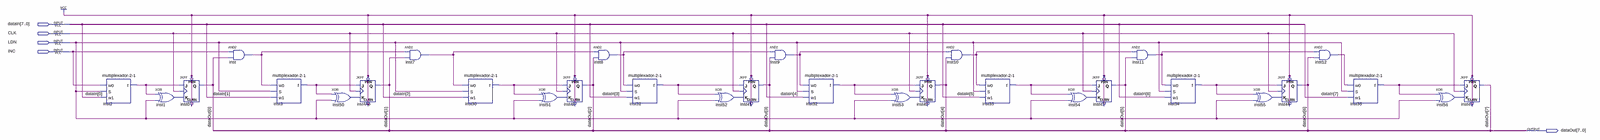
[diagram p0: schematic sheet, whole]
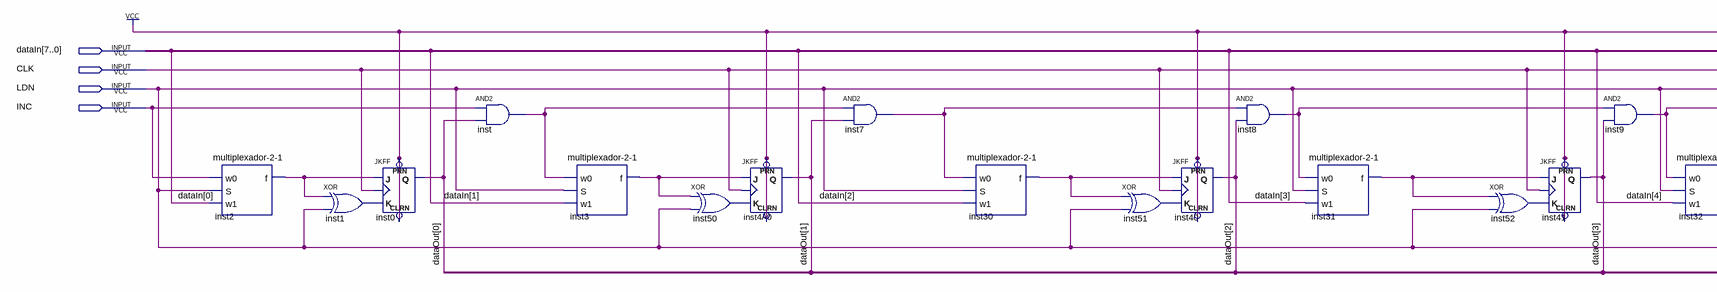
[diagram p1: schematic sheet, left part]
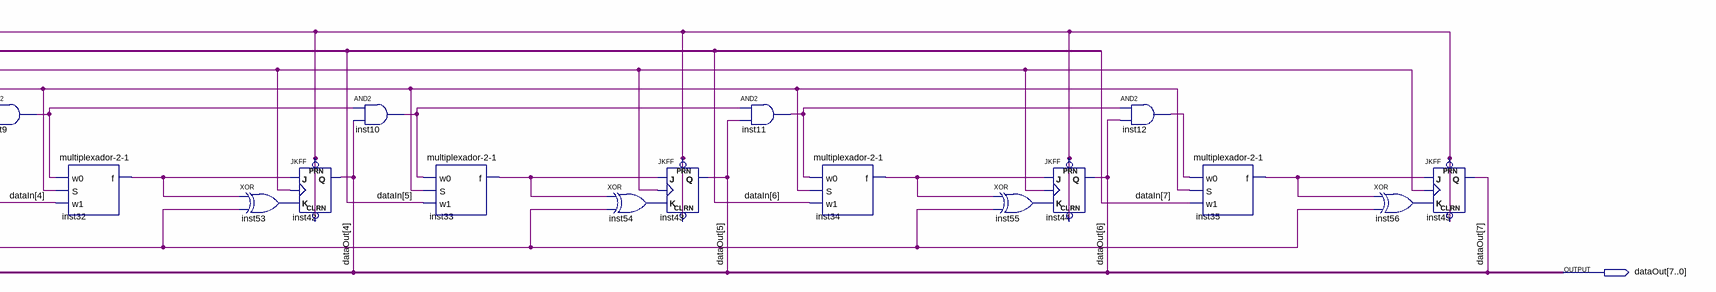
[diagram p2: schematic sheet, right part]
// Quartus schematic registradorPC.bdf as structural Verilog: 31 symbols, 5 pins
module registradorPC (
  input  [7:0] dataIn,
  input  CLK,
  input  LDN,
  input  INC,
  output [7:0] dataOut
);

  wire inst1_out, inst2_f, inst3_f, inst7_out, inst8_out, inst9_out, inst10_out, inst11_out, inst12_out,
       inst30_f, inst31_f, inst32_f, inst33_f, inst34_f, inst35_f, inst50_out, inst51_out, inst52_out,
       inst53_out, inst54_out, inst55_out, inst56_out, inst_out;

  \multiplexador-2-1  inst2 (.w0(INC), .S(LDN), .w1(dataIn[0]), .f(inst2_f));
  xor inst1 (inst1_out, inst2_f, LDN);
  JKFF inst0 (.PRN(1'b1), .CLRN(1'b1), .K(inst1_out), .J(inst2_f), .CLK(CLK), .Q(dataOut[0]));
  and inst (inst_out, INC, dataOut[0]);
  \multiplexador-2-1  inst3 (.w0(inst_out), .S(LDN), .w1(dataIn[1]), .f(inst3_f));
  xor inst50 (inst50_out, inst3_f, LDN);
  JKFF inst4A0 (.PRN(1'b1), .CLRN(1'b1), .K(inst50_out), .J(inst3_f), .CLK(CLK), .Q(dataOut[1]));
  and inst7 (inst7_out, inst_out, dataOut[1]);
  \multiplexador-2-1  inst30 (.w0(inst7_out), .S(LDN), .w1(dataIn[2]), .f(inst30_f));
  xor inst51 (inst51_out, inst30_f, LDN);
  JKFF inst40 (.PRN(1'b1), .CLRN(1'b1), .K(inst51_out), .J(inst30_f), .CLK(CLK), .Q(dataOut[2]));
  and inst8 (inst8_out, inst7_out, dataOut[2]);
  \multiplexador-2-1  inst31 (.w0(inst8_out), .S(LDN), .w1(dataIn[3]), .f(inst31_f));
  xor inst52 (inst52_out, inst31_f, LDN);
  JKFF inst41 (.PRN(1'b1), .CLRN(1'b1), .K(inst52_out), .J(inst31_f), .CLK(CLK), .Q(dataOut[3]));
  and inst9 (inst9_out, inst8_out, dataOut[3]);
  \multiplexador-2-1  inst32 (.w0(inst9_out), .S(LDN), .w1(dataIn[4]), .f(inst32_f));
  xor inst53 (inst53_out, inst32_f, LDN);
  JKFF inst42 (.PRN(1'b1), .CLRN(1'b1), .K(inst53_out), .J(inst32_f), .CLK(CLK), .Q(dataOut[4]));
  and inst10 (inst10_out, inst9_out, dataOut[4]);
  \multiplexador-2-1  inst33 (.w0(inst10_out), .S(LDN), .w1(dataIn[5]), .f(inst33_f));
  xor inst54 (inst54_out, inst33_f, LDN);
  JKFF inst43 (.PRN(1'b1), .CLRN(1'b1), .K(inst54_out), .J(inst33_f), .CLK(CLK), .Q(dataOut[5]));
  and inst11 (inst11_out, inst10_out, dataOut[5]);
  \multiplexador-2-1  inst34 (.w0(inst11_out), .S(LDN), .w1(dataIn[6]), .f(inst34_f));
  xor inst55 (inst55_out, inst34_f, LDN);
  JKFF inst44 (.PRN(1'b1), .CLRN(1'b1), .K(inst55_out), .J(inst34_f), .CLK(CLK), .Q(dataOut[6]));
  and inst12 (inst12_out, inst11_out, dataOut[6]);
  \multiplexador-2-1  inst35 (.w0(inst12_out), .S(LDN), .w1(dataIn[7]), .f(inst35_f));
  xor inst56 (inst56_out, inst35_f, LDN);
  JKFF inst45 (.PRN(1'b1), .CLRN(1'b1), .K(inst56_out), .J(inst35_f), .CLK(CLK), .Q(dataOut[7]));
endmodule
